# Altium schematic sheet MainBoard_Motor1.SchDoc
size A3
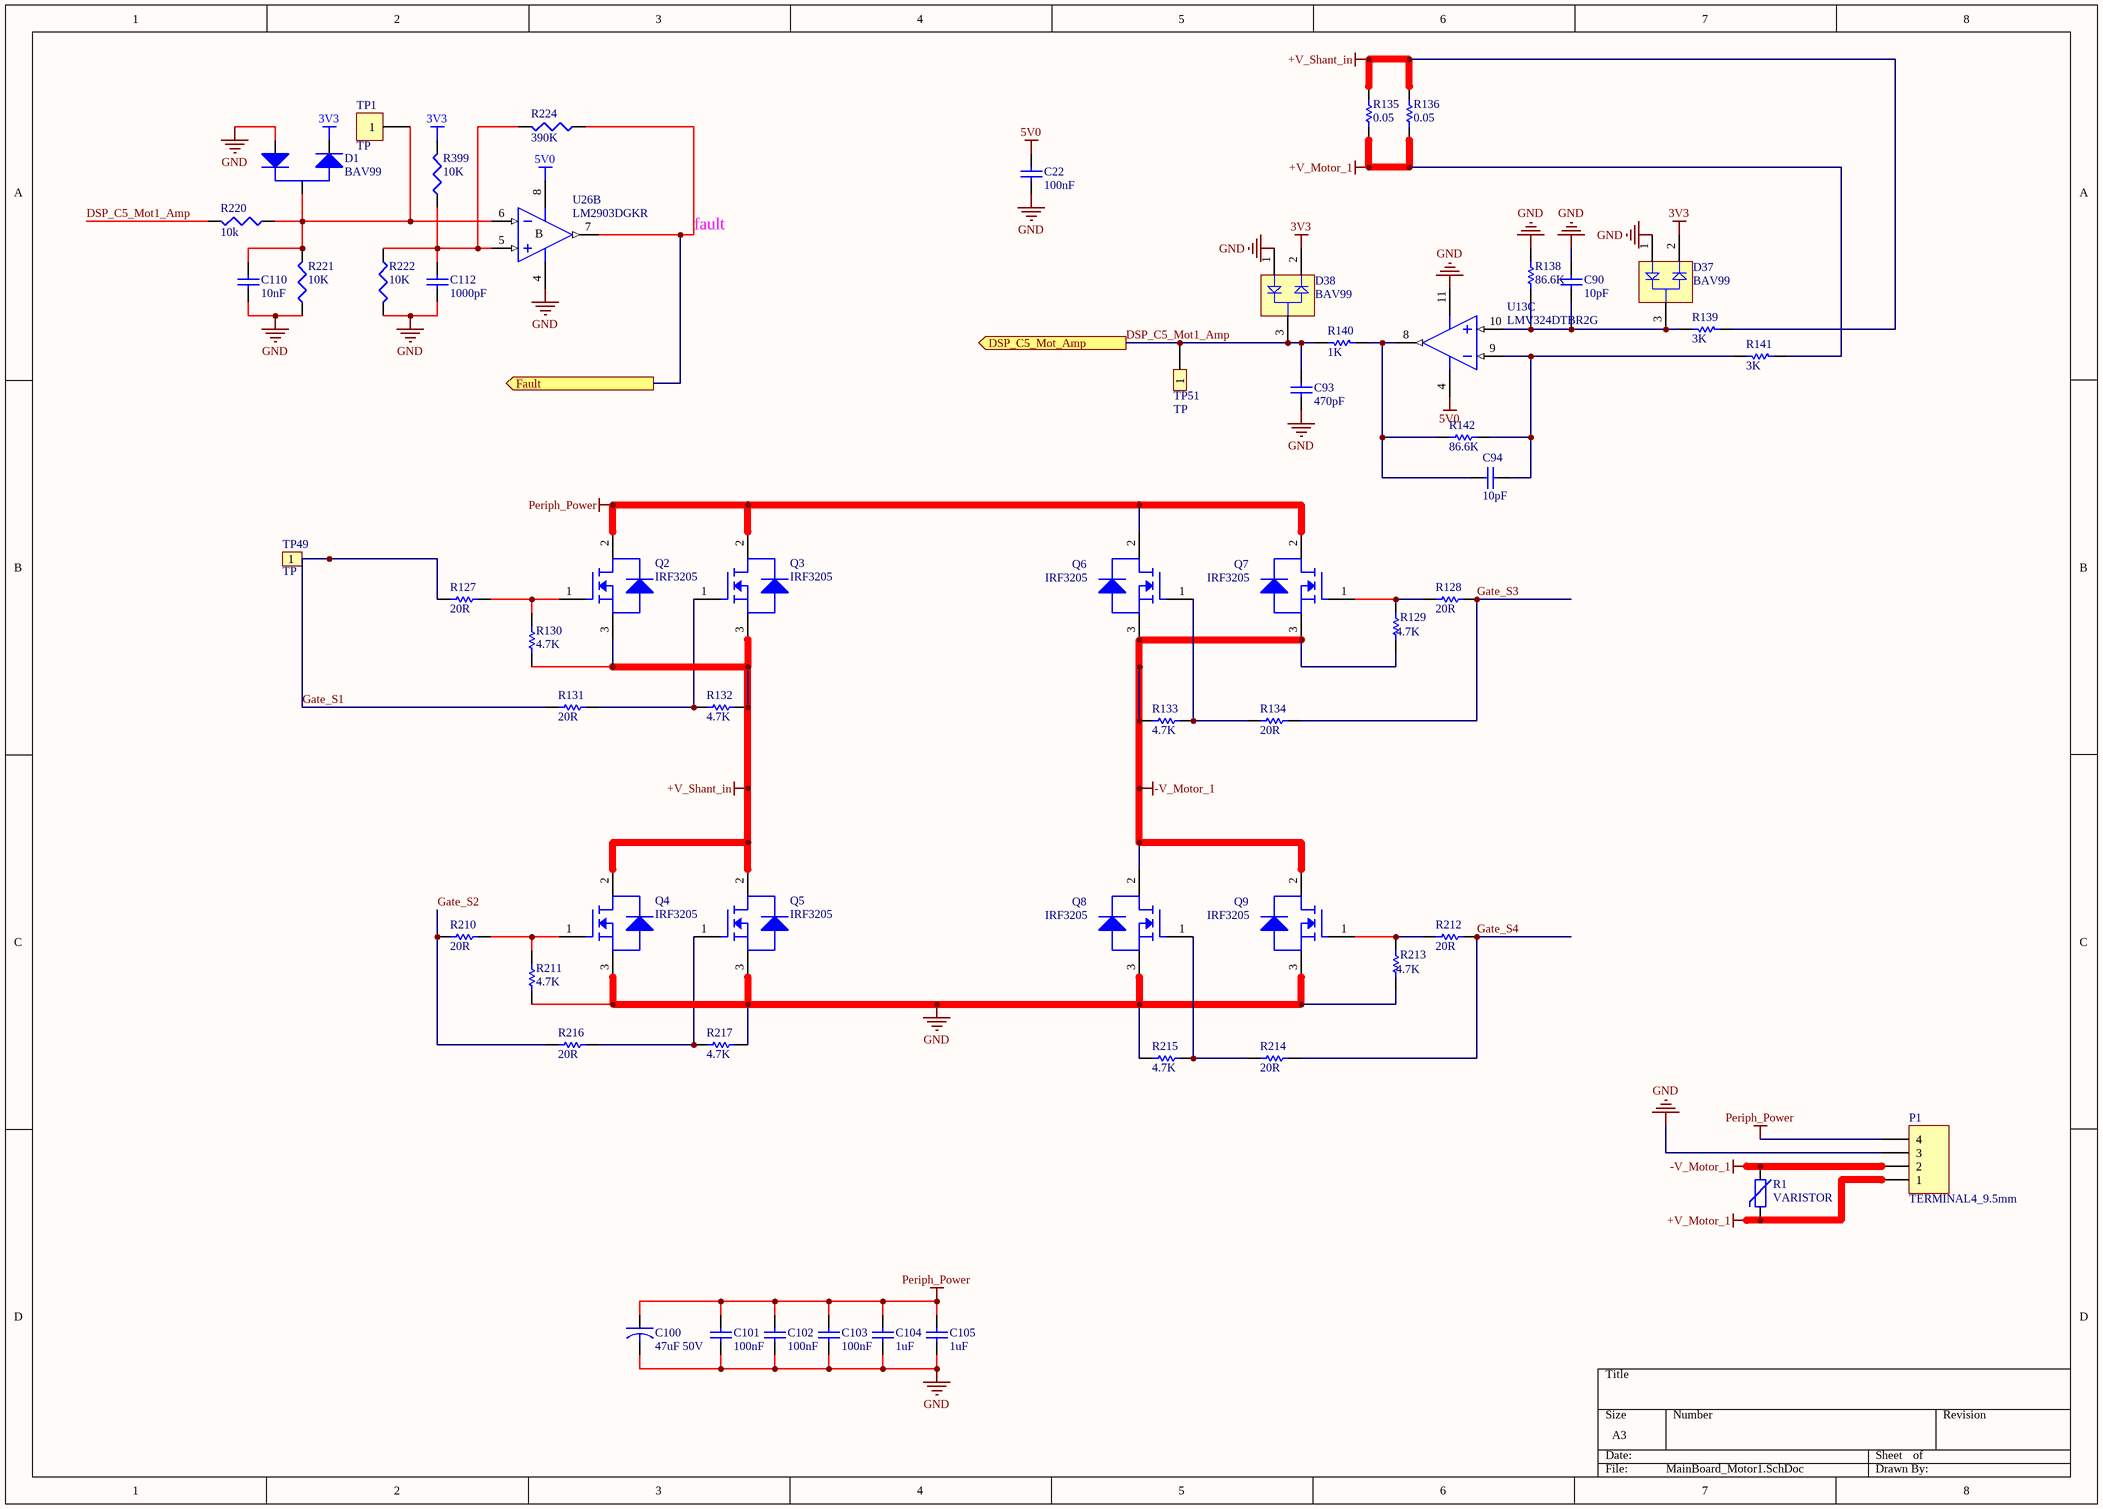
[diagram p0: MainBoard_Motor1.SchDoc]

## Parts
C22  100nF  [C0603]
C90  10pF  [C0603]
C93  470pF  [C0603]
C94  10pF  [C0603]
C100  47uF 50V  [RB-SGF-6.3MM]
C101  100nF  [C0805]
C102  100nF  [C0805]
C103  100nF  [C0805]
C104  1uF  [C0805]
C105  1uF  [C0805]
C110  10nF  [0603-C-PW]
C112  1000pF  [0603-C-PW]
D1  BAV99  [SOT-23-PW]
D37  BAV99  [SOT-23]
D38  BAV99  [SOT-23]
P1  TERMINAL4_9.5mm  [Terminal 9.5mm_4]
Q2  IRF3205  [TO-220]
Q3  IRF3205  [TO-220]
Q4  IRF3205  [TO-220]
Q5  IRF3205  [TO-220]
Q6  IRF3205  [TO-220]
Q7  IRF3205  [TO-220]
Q8  IRF3205  [TO-220]
Q9  IRF3205  [TO-220]
R1  VARISTOR  [VARISTOR]
R127  20R  [R1206]
R128  20R  [R1206]
R129  4.7K  [R0805]
R130  4.7K  [R0805]
R131  20R  [R1206]
R132  4.7K  [R0805]
R133  4.7K  [R0805]
R134  20R  [R1206]
R135  0.05  [2512]
R136  0.05  [2512]
R138  86.6K  [R0603]
R139  3K  [R0603]
R140  1K  [R0603]
R141  3K  [R0603]
R142  86.6K  [R0603]
R210  20R  [R1206]
R211  4.7K  [R0805]
R212  20R  [R1206]
R213  4.7K  [R0805]
R214  20R  [R1206]
R215  4.7K  [R0805]
R216  20R  [R1206]
R217  4.7K  [R0805]
R220  10k  [0603-R-PW]
R221  10K  [0603-R-PW]
R222  10K  [0402-R-PW]
R224  390K  [0603-R-PW]
R399  10K  [0603-R-PW]
TP1  TP  [TP-SMD-1MM]
TP49  TP  [TP_1mm]  (no BOM)
TP51  TP  [TP_1mm]  (no BOM)
U13  LMV324DTBR2G  [SO-14]  (part C of 4)
U26  LM2903DGKR  [TSSOP_8-PW]  (part B of 2)

## Ports
DSP_C5_Mot_Amp (out), Fault (out)

## Nets
3V3: D1.2(K) D37.2(K2) D38.2(K2) R399.2
5V0: C22.2 U13.4(V+) U26.8(V+)
+V_Motor_1: P1.1 R1.2 R135.2 R136.2 R141.1
+V_Shant_in: Q2.3(S) Q3.3(S) Q4.2(D) Q5.2(D) R130.1 R132.1 R135.1 R136.1 R139.1
-V_Motor_1: P1.2 Q6.3(S) Q7.3(S) Q8.2(D) Q9.2(D) R1.1 R129.1 R133.2
GND: C22.1 C90.2 C93.1 C100.2 C101.1 C102.1 C103.1 C104.1 C105.1 C110.1 C112.1 D1.1(A) D37.1(A1) D38.1(A1) P1.3 Q4.3(S) Q5.3(S) Q8.3(S) Q9.3(S) R138.2 R211.1 R213.1 R215.2 R217.1 R221.1 R222.1 U13.11(V-) U26.4(V-)
Periph_Power: C100.1 C101.2 C102.2 C103.2 C104.2 C105.2 P1.4 Q2.2(D) Q3.2(D) Q6.2(D) Q7.2(D)
DSP_C5_Mot1_Amp: C93.2 D38.3(C) R140.1 R220.2 TP51.1 ; port DSP_C5_Mot_Amp
fault: R224.2 U26.7(OUT) ; port Fault
Gate_S1: R127.1 R131.1 TP49.1
Gate_S2: R210.1 R216.1
Gate_S3: R128.2 R134.2
Gate_S4: R212.2 R214.2
NetC90_1: C90.1 D37.3(C) R138.1 R139.2 U13.10(INC+)
NetC94_1: C94.1 R140.2 R142.1 U13.8(OUTC)
NetC94_2: C94.2 R141.2 R142.2 U13.9(INC-)
NetC110_2: C110.2 D1.3(AK) R220.1 R221.2 TP1.1 U26.6(IN-)
NetC112_2: C112.2 R222.2 R224.1 R399.1 U26.5(IN+)
NetQ2_1: Q2.1(G) R127.2 R130.2
NetQ3_1: Q3.1(G) R131.2 R132.2
NetQ4_1: Q4.1(G) R210.2 R211.2
NetQ5_1: Q5.1(G) R216.2 R217.2
NetQ6_1: Q6.1(G) R133.1 R134.1
NetQ7_1: Q7.1(G) R128.1 R129.2
NetQ8_1: Q8.1(G) R214.1 R215.1
NetQ9_1: Q9.1(G) R212.1 R213.2

## Notes on the sheet
- (in symbol LM2903DGKR, part B) B

## Library data of the parts
C22 = C0402: Ceramic Chip Capacitor - Standard; Manufacturer: Yageo; MFR PART NO: CC0603KPX7R9BB104; Note: Footprint corresponds to dimensions for bulk cassette packaging. This case size has tightened tolerances.; Published: 17-Jul-2002; LatestRevisionDate: 19-Mar-2004; LatestRevisionNote: Silkscreen size reduced.; DatasheetDocument: Mar-2001; PackageDocument: Mar-2001; PackageReference: 0402; Publisher: Altium Limited; Code_JEITA: 0402; Code_IPC: 1005 [0402]; ComponentLink1Description: Manufacturer Link; ComponentLink1URL: http://www.kemet.com/; ComponentLink2Description: Datasheet; ComponentLink2URL: http://www.kemet.com/kemet/web/homepage/kechome.nsf/vapubfilesname/F3102TA.pdf/$file/F3102TA.pdf; Value: 100nF
C90 C94 = Cap_510pF_50V_0603: Cap_10pF_5%_C0G_50V_0603; Manufacturer: Yageo; MFR PART NO: CC0603JRNPO9BN510; SAP: 10021841; ComponentLink1Description: Manufacturer Link; ComponentLink1URL: http://www.kemet.com/; ComponentLink2Description: Datasheet; ComponentLink2URL: http://www.kemet.com/kemet/web/homepage/kechome.nsf/vapubfilesname/F3102TA.pdf/$file/F3102TA.pdf
C93 = Cap_470pF_50V_0603: Cap_470pF_5%_C0G_50V_0603; MFR PART NO: CC0603JRNPO9BN471; Manufacturer: Yageo
C100 = Cap_47uF 50V_EL_6.3mm: Cap_47uF 50V_Pitch2.5mm; MFR PART NO: ERS1HM470E11OT; Manufacturer: AIHUA; SAP: 10023070
C101-C103 = Cap_100nF_50V_0805: Cap_100nF_5%_X7R_50V_0805; Manufacturer: VISHAY; MFR PART NO: VJ0805Y104JXAAT; SAP: 10010690
C104 C105 = Cap_1uF_50V_0805: Cap_1uF_20%_X5R_50V_0805; MFR PART NO: UMK212BJ105MGHT; Manufacturer: Taiyo Yuden; SAP: 10021804
C110 = Cap: CAP CER 10000PF 50V X7R 0603; Manufacturer: Yageo; MFR PART NO: AC0603KPX7R9BB103; Value: MKP63 472M 300~Y2-4.7nF; Published: 8-Jun-2000; LatestRevisionDate: 17-Jul-2002; LatestRevisionNote: Re-released for DXP Platform.; PackageReference: RAD-0.3; Publisher: Altium Limited; PackageDescription: Radial Cap, Thru-Hole; 2 Leads; 0.3 in Pin Spacing
C112 = Cap: CAP CER 1000PF 50V X7R 0603; Manufacturer: Yageo; MFR PART NO: CC0603KRX7R9BB102; Value: MKP63 472M 300~Y2-4.7nF; Published: 8-Jun-2000; LatestRevisionDate: 17-Jul-2002; LatestRevisionNote: Re-released for DXP Platform.; PackageReference: RAD-0.3; Publisher: Altium Limited; PackageDescription: Radial Cap, Thru-Hole; 2 Leads; 0.3 in Pin Spacing
D1 = BAV99: DIODE ARRAY GP 100V 215MA SOT23; Manufacturer: Nexperia; MFR PART NO: BAV99,215
D37 D38 = BAV99: Dِiode_BAV99_A7W_SOT23; Manufacturer: Diode Incorporated; MFR PART NO: BAV99-7-F; Green: TRUE; Packing: Reel; PackageVersion: Apr-08; PackageReference: SOT23; PackageDescription: 3-Pin Small Outline Transistor Package, 1.3 x 2.9 mm Body, 0.95 mm Pitch; Supplier 1: Arrow; Supplier Part Number 1: 8_hDx09NysxyY_EZJdaSbs5L1p9U5ut-2MaZMQWGOaA; Supplier 2: Farnell; Supplier Part Number 2: 1056504RL; Supplier 3: Farnell; Supplier Part Number 3: 1056504; Mounting Technology: Surface Mount; ComponentLink1Description: Manufacturer URL; ComponentLink1URL: http://www.infineon.com/; ComponentLink2Description: Datasheet; ComponentLink2URL: http://www.infineon.com/dgdl/bav99series.pdf?folderId=db3a30431400ef6801141b5844e103ea&fileId=db3a30431400ef6801141c1b237d042f; ComponentLink3Description: Package Specification; ComponentLink3URL: http://www.infineon.com/dgdl/smbta14_mmbta14.pdf?folderId=db3a30431441fb5d011445c30f210183&fileId=db3a30431441fb5d011445ef0201018c
P1 = TERMINAL4_9.5mm: T44-9.5mm_4; Manufacturer: Cixi Kefa Elec; MFR PART NO: KF45C-9-5-4P
Q2-Q9 = MOS_IRF3205: MOSFET N-CHANNEL_ 55V_ TO-220; Manufacturer: International Rectifier; MFR PART NO: IRF3205
R1 = VARISTOR: 35V 2cm; Manufacturer: TDK Epcos; MFR PART NO: B72220S0350K101
R127 R128 R131 R134 R210 R212 R214 R216 = Res_20R_1206: Res_20R_1%_0.25W_1206; Manufacturer: Yageo; MFR PART NO: RC1206FR-0720RL; SAP: 10021877
R129 R130 R132 R133 R211 R213 R215 R217 = Res_4.7K_0805: Res_4.7K_1%_0805; Manufacturer: Yageo; MFR PART NO: RC0805FR-074K7L; SAP: 10021870
R135 R136 = Res_0.05_2512: Res_0.05_1%_2512; Manufacturer: Bourns Inc.; MFR PART NO: CRA2512-FZ-R050ELF
R138 R142 = Res_86.6K_0603: Res_86.6K_1%_0603; Manufacturer: Yageo; MFR PART NO: AC0603FR-0786K6L
R139 R141 = Res_3K_0603: Res_3K_1%_0603; Manufacturer: Yageo; MFR PART NO: RC0603FR-073KL; SAP: 10016031
R140 = ERAV: RES SMD 1K OHM 1% 1/10W 0603; Manufacturer: Yageo; MFR PART NO: RC0603FR-071KL; Note: If flow soldering, adjust pad width of PCB Footprint to 0.7 - 0.8 times the width of the resistor.; Published: 17-Dec-2003; LatestRevisionDate: 19-Mar-2004; LatestRevisionNote: Silkscreen size reduced.; PackageDocument: Mar-2003; PackageReference: ERA-0603; Publisher: Altium Limited; Code_IPC: 1608 [0603]; ComponentLink1Description: Manufacturer Link; ComponentLink1URL: http://www.panasonic.com/industrial/components/resistive_products.htm; ComponentLink2Description: Datasheet; ComponentLink2URL: http://www.panasonic.com/industrial/components/pdf/AOF0000CE1.pdf; VALUE: 1K
R220 = RES1: RES SMD 47K OHM 1% 1/10W 0603; Manufacturer: Yageo; MFR PART NO: RC0603FR-0747KL
R221 = RES1: RES SMD 3.9K OHM 1% 1/10W 0603; Manufacturer: Yageo; MFR PART NO: RC0603FR-073K9L
R222 = RES1: RES SMD 11K OHM 1% 1/16W 0402; Manufacturer: Yageo; MFR PART NO: RC0402FR-0711KL
R224 = RES1: Res Thick Film 0603 390K Ohm 1% 0.1W; Manufacturer: Yageo; MFR PART NO: AC0603FR-07390KL
R399 = RES1: RES, THICK FILM, 4K7, 1%, 0.1W, 0603; Manufacturer: Yageo; MFR PART NO: RC0603FR-134K7L
TP1 = Header 1: Header, 1-Pin; LatestRevisionDate: 17-Jul-2002; LatestRevisionNote: Re-released for DXP Platform.; Publisher: Altium Limited
TP49 TP51 = TEST-POINT: LatestRevisionDate: 17-Jul-2002; LatestRevisionNote: Re-released for DXP Platform.; Publisher: Altium Limited
U13 = LMV324DTBR2G: IC_OpAmp_Quad_TSSOP-14; Manufacturer: On Semiconductor; GBW Typ (MHz): 1; Packing: Tape and Reel; VCC Max (V): 5.5; VCC Min (V): 2.7; DatasheetVersion: Rev. 10; PackageVersion: Rev. B, 10/2006; PackageReference: TSSOP-14-948G-01; PackageDescription: 14-Pin Small Outline Package, Body 5 x 4.4 mm, Pitch 0.65 mm; Supplier 1: Digi-Key; Supplier Part Number 1: LMV324DTBR2G-ND; Supplier 2: Newark; Supplier Part Number 2: 01P4987; Supplier 3: Mouser; Supplier Part Number 3: 863-LMV324DTBR2G; RoHS: TRUE; SR Typ (V/uS): 1; Mounting Technology: Surface Mount; PartNumber: LMV324DTBR2G; ComponentLink1Description: Manufacturer URL; ComponentLink1URL: http://www.onsemi.com/; ComponentLink2Description: Datasheet; ComponentLink2URL: http://www.onsemi.cn/pub_link/Collateral/LMV321-LMV358-LMV324-D.PDF; ComponentLink3Description: Package Specification; ComponentLink3URL: http://www.onsemi.com/pub_link/Collateral/948G-01.PDF; MFR PART NO: LMV324DTBR2G
U26 = LM2903DGKR: IC DUAL DIFF COMPARATOR 8VSSOP; Manufacturer: Texas Instruments; Published: 24-Aug-2001; LatestRevisionDate: 06-Jun-2005; LatestRevisionNote: Stylized 3D Model Added.; DatasheetVersion: Jun-1998; PackageReference: DIP8; Publisher: Altium Limited; PackageDescription: DIP; 8 Leads; Row Spacing 7.62 mm; Pitch 2.54 mm; Code_JEDEC: MO-001-AN; ComponentLink1Description: Manufacturer Link; ComponentLink1URL: http://www.st.com/; ComponentLink2Description: Datasheet; ComponentLink2URL: http://www.st.com/stonline/products/literature/ds/2163/lm358.pdf; MFR PART NO: LM2903DGKR